# Altium schematic sheet EpicCubeDiagram2.SchDoc
size B; Organization: Altium Limited; Address1: L3, 12a Rodborough Rd; Address2: Frenchs Forest; Address3: NSW; Address4: Australia 2086; SheetNumber: 2; SheetTotal: 2
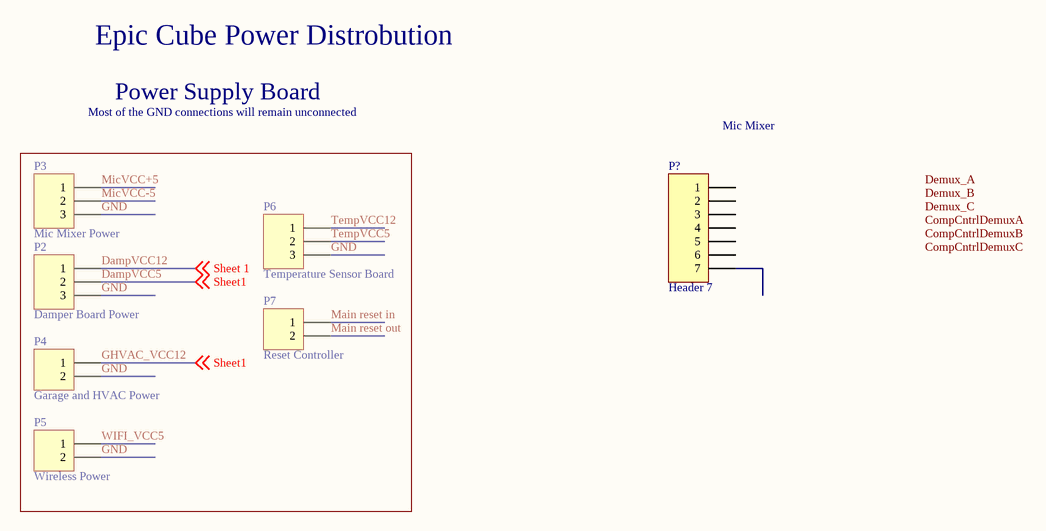
[diagram p0: EpicCubeDiagram2.SchDoc]

## Parts
P2  Damper Board Power  [HDR1X3]
P3  Mic Mixer Power  [HDR1X3]
P4  Garage and HVAC Power  [HDR1X2]
P5  Wireless Power  [HDR1X2]
P6  Temperature Sensor Board  [HDR1X3]
P7  Reset Controller  [HDR1X2]
P?  Header 7  [HDR1X7]

## Nets
DampVCC5: P2.2 P4.1 ; off-sheet Sheet1  [also labelled GHVAC_VCC12, Sheet1]
DampVCC12: P2.1 ; off-sheet Sheet 1  [also labelled Sheet 1]
GND: P2.3 P3.3 P4.2 P5.2 P6.3
Main reset in: P7.1
Main reset out: P7.2
MicVCC+5: P3.1
MicVCC-5: P3.2
TempVCC5: P6.2
TempVCC12: P6.1
WIFI_VCC5: P5.1

Not connected (* = marked no-connect by the designer): P? 1 2 3 4 5 6 7

## Notes on the sheet
- Epic Cube Power Distrobution
- Most of the GND connections will remain unconnected
- Power Supply Board
- Mic Mixer
- Labels drawn without touching a wire or pin: CompCntrlDemuxA, CompCntrlDemuxB, CompCntrlDemuxC, Demux_A, Demux_B, Demux_C
- Title
- Size:
- Date:
- B
- Number:
- Time:
- Revision:
- Sheet
- of
- File:

## Library data of the parts
P2 P3 P6 = Header 3: Header, 3-Pin; LatestRevisionDate: 17-Jul-2002; LatestRevisionNote: Re-released for DXP Platform.; Publisher: Altium Limited
P4 P5 P7 = Header 2: Header, 2-Pin; LatestRevisionDate: 17-Jul-2002; LatestRevisionNote: Re-released for DXP Platform.; Publisher: Altium Limited
P? = Header 7: Header, 7-Pin; LatestRevisionDate: 17-Jul-2002; LatestRevisionNote: Re-released for DXP Platform.; Publisher: Altium Limited